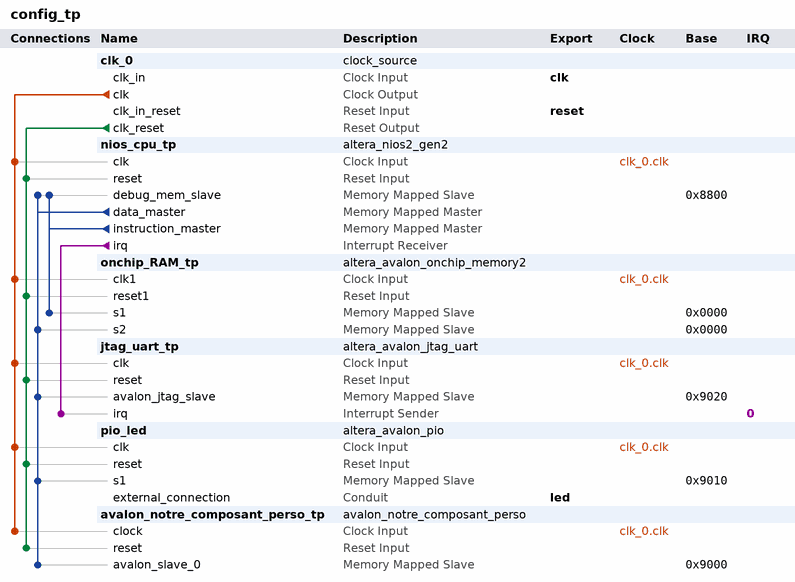
[diagram p0: system contents]
# Platform Designer (Qsys) system config_tp, Cyclone IV E EP4CE22F17C6
# Parameters at their usual value, and those the tool derives, are not listed.
package require -exact qsys 18.1
create_system config_tp
set_project_property DEVICE_FAMILY {Cyclone IV E}
set_project_property DEVICE EP4CE22F17C6

add_instance clk_0 clock_source 18.1
set_instance_parameter_value clk_0 clockFrequency 50000000

add_instance nios_cpu_tp altera_nios2_gen2 18.1
set_instance_parameter_value nios_cpu_tp dcache_size 2048
set_instance_parameter_value nios_cpu_tp exceptionSlave onchip_RAM_tp.s1
set_instance_parameter_value nios_cpu_tp icache_size 4096
set_instance_parameter_value nios_cpu_tp impl Tiny
set_instance_parameter_value nios_cpu_tp resetSlave onchip_RAM_tp.s1

add_instance onchip_RAM_tp altera_avalon_onchip_memory2 18.1
set_instance_parameter_value onchip_RAM_tp dataWidth 32
set_instance_parameter_value onchip_RAM_tp dualPort true
set_instance_parameter_value onchip_RAM_tp initMemContent true
set_instance_parameter_value onchip_RAM_tp initializationFileName onchip_mem.hex
set_instance_parameter_value onchip_RAM_tp memorySize 32768
set_instance_parameter_value onchip_RAM_tp singleClockOperation true

add_instance jtag_uart_tp altera_avalon_jtag_uart 18.1
set_instance_parameter_value jtag_uart_tp simInteractiveOptions NO_INTERACTIVE_WINDOWS

add_instance pio_led altera_avalon_pio 18.1
set_instance_parameter_value pio_led direction Output
set_instance_parameter_value pio_led width 8

add_instance avalon_notre_composant_perso_tp avalon_notre_composant_perso 1.0

# connections
add_connection clk_0.clk avalon_notre_composant_perso_tp.clock clock
add_connection clk_0.clk jtag_uart_tp.clk clock
add_connection clk_0.clk nios_cpu_tp.clk clock
add_connection clk_0.clk onchip_RAM_tp.clk1 clock
add_connection clk_0.clk pio_led.clk clock
add_connection clk_0.clk_reset avalon_notre_composant_perso_tp.reset reset
add_connection clk_0.clk_reset jtag_uart_tp.reset reset
add_connection clk_0.clk_reset nios_cpu_tp.reset reset
add_connection clk_0.clk_reset onchip_RAM_tp.reset1 reset
add_connection clk_0.clk_reset pio_led.reset reset
add_connection nios_cpu_tp.data_master avalon_notre_composant_perso_tp.avalon_slave_0 avalon
set_connection_parameter_value nios_cpu_tp.data_master/avalon_notre_composant_perso_tp.avalon_slave_0 baseAddress 0x9000
add_connection nios_cpu_tp.data_master jtag_uart_tp.avalon_jtag_slave avalon
set_connection_parameter_value nios_cpu_tp.data_master/jtag_uart_tp.avalon_jtag_slave baseAddress 0x9020
add_connection nios_cpu_tp.data_master nios_cpu_tp.debug_mem_slave avalon
set_connection_parameter_value nios_cpu_tp.data_master/nios_cpu_tp.debug_mem_slave baseAddress 0x8800
add_connection nios_cpu_tp.data_master onchip_RAM_tp.s2 avalon
set_connection_parameter_value nios_cpu_tp.data_master/onchip_RAM_tp.s2 baseAddress 0x0000
add_connection nios_cpu_tp.data_master pio_led.s1 avalon
set_connection_parameter_value nios_cpu_tp.data_master/pio_led.s1 baseAddress 0x9010
add_connection nios_cpu_tp.instruction_master nios_cpu_tp.debug_mem_slave avalon
set_connection_parameter_value nios_cpu_tp.instruction_master/nios_cpu_tp.debug_mem_slave baseAddress 0x8800
add_connection nios_cpu_tp.instruction_master onchip_RAM_tp.s1 avalon
set_connection_parameter_value nios_cpu_tp.instruction_master/onchip_RAM_tp.s1 baseAddress 0x0000
add_connection nios_cpu_tp.irq jtag_uart_tp.irq interrupt
set_connection_parameter_value nios_cpu_tp.irq/jtag_uart_tp.irq irqNumber 0

# exported interfaces
add_interface clk clock sink
set_interface_property clk EXPORT_OF clk_0.clk_in
add_interface led conduit end
set_interface_property led EXPORT_OF pio_led.external_connection
add_interface reset reset sink
set_interface_property reset EXPORT_OF clk_0.clk_in_reset

set_interconnect_requirement {$system} qsys_mm.clockCrossingAdapter HANDSHAKE
set_interconnect_requirement {$system} qsys_mm.enableEccProtection FALSE
set_interconnect_requirement {$system} qsys_mm.insertDefaultSlave FALSE
set_interconnect_requirement {$system} qsys_mm.maxAdditionalLatency 1

save_system config_tp.qsys
